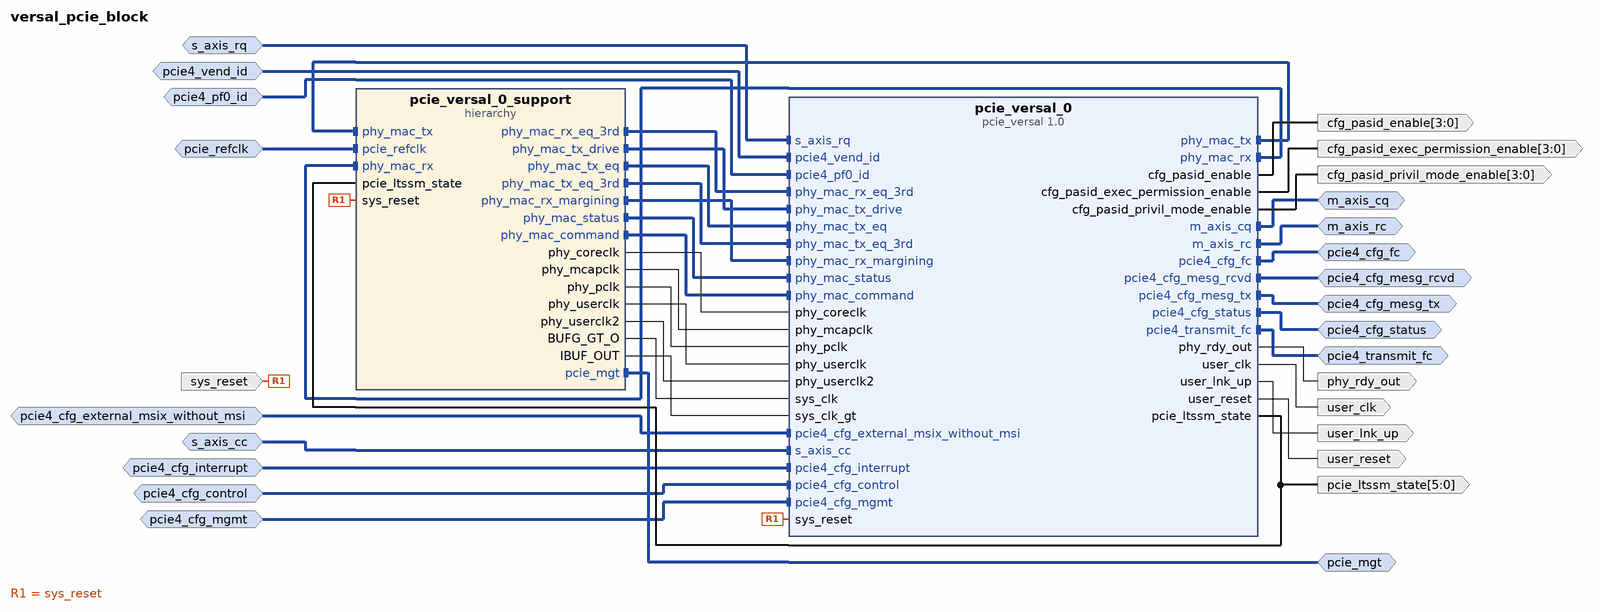
[diagram p0: block diagram of the top level]
# Vivado block design versal_pcie_block, xcvm1802-vsva2197-2MP-e-S-es1, Vivado 2020.1
create_bd_design versal_pcie_block

create_bd_intf_port -mode Slave -vlnv xilinx.com:interface:diff_clock_rtl:1.0 pcie_refclk
create_bd_intf_port -mode Master -vlnv xilinx.com:interface:gt_rtl:1.0 pcie_mgt
create_bd_intf_port -mode Slave -vlnv xilinx.com:interface:axis_rtl:1.0 s_axis_cc
set_property -dict [list \
  CONFIG.TDATA_NUM_BYTES 64 \
  CONFIG.TDEST_WIDTH 0 \
  CONFIG.TID_WIDTH 0 \
  CONFIG.TUSER_WIDTH 81 \
  CONFIG.HAS_TREADY 1 \
  CONFIG.HAS_TSTRB 0 \
  CONFIG.HAS_TKEEP 1 \
  CONFIG.HAS_TLAST 1 \
  CONFIG.FREQ_HZ 250000000 \
  CONFIG.LAYERED_METADATA undef \
] [get_bd_intf_ports s_axis_cc]
create_bd_intf_port -mode Slave -vlnv xilinx.com:interface:pcie4_cfg_mgmt_rtl:1.0 pcie4_cfg_mgmt
create_bd_intf_port -mode Slave -vlnv xilinx.com:interface:pcie4_pcie_id_rtl:1.0 pcie4_vend_id
create_bd_intf_port -mode Slave -vlnv xilinx.com:interface:axis_rtl:1.0 s_axis_rq
set_property -dict [list \
  CONFIG.TDATA_NUM_BYTES 64 \
  CONFIG.TDEST_WIDTH 0 \
  CONFIG.TID_WIDTH 0 \
  CONFIG.TUSER_WIDTH 183 \
  CONFIG.HAS_TREADY 1 \
  CONFIG.HAS_TSTRB 0 \
  CONFIG.HAS_TKEEP 1 \
  CONFIG.HAS_TLAST 1 \
  CONFIG.FREQ_HZ 250000000 \
  CONFIG.LAYERED_METADATA undef \
] [get_bd_intf_ports s_axis_rq]
create_bd_intf_port -mode Slave -vlnv xilinx.com:interface:pcie4_cfg_msix_rtl:1.0 pcie4_cfg_external_msix_without_msi
create_bd_intf_port -mode Slave -vlnv xilinx.com:interface:pcie3_cfg_interrupt_rtl:1.0 pcie4_cfg_interrupt
create_bd_intf_port -mode Slave -vlnv xilinx.com:interface:pcie4_cfg_control_rtl:1.0 pcie4_cfg_control
create_bd_intf_port -mode Slave -vlnv xilinx.com:interface:pcie4_pcie_id_rtl:1.0 pcie4_pf0_id
create_bd_intf_port -mode Master -vlnv xilinx.com:interface:pcie3_cfg_mesg_tx_rtl:1.0 pcie4_cfg_mesg_tx
create_bd_intf_port -mode Master -vlnv xilinx.com:interface:axis_rtl:1.0 m_axis_rc
set_property -dict {CONFIG.FREQ_HZ 250000000} [get_bd_intf_ports m_axis_rc]
create_bd_intf_port -mode Master -vlnv xilinx.com:interface:pcie4_cfg_status_rtl:1.0 pcie4_cfg_status
create_bd_intf_port -mode Master -vlnv xilinx.com:interface:pcie3_transmit_fc_rtl:1.0 pcie4_transmit_fc
create_bd_intf_port -mode Master -vlnv xilinx.com:interface:pcie_cfg_fc_rtl:1.1 pcie4_cfg_fc
create_bd_intf_port -mode Master -vlnv xilinx.com:interface:pcie3_cfg_msg_received_rtl:1.0 pcie4_cfg_mesg_rcvd
create_bd_intf_port -mode Master -vlnv xilinx.com:interface:axis_rtl:1.0 m_axis_cq
set_property -dict {CONFIG.FREQ_HZ 250000000} [get_bd_intf_ports m_axis_cq]
create_bd_port -dir I -type rst sys_reset
create_bd_port -dir O -from 3 -to 0 cfg_pasid_privil_mode_enable
create_bd_port -dir O -from 3 -to 0 cfg_pasid_exec_permission_enable
create_bd_port -dir O phy_rdy_out
create_bd_port -dir O -from 3 -to 0 cfg_pasid_enable
create_bd_port -dir O -from 5 -to 0 pcie_ltssm_state
create_bd_port -dir O user_lnk_up
create_bd_port -dir O -type rst user_reset
create_bd_port -dir O -type clk user_clk
set_property -dict [list \
  CONFIG.ASSOCIATED_BUSIF s_axis_cc:s_axis_rq:m_axis_rc:m_axis_cq \
  CONFIG.FREQ_HZ 250000000 \
] [get_bd_ports user_clk]

create_bd_cell -type ip -vlnv xilinx.com:ip:pcie_versal:1.0 pcie_versal_0
set_property -dict [list \
  CONFIG.AXISTEN_IF_EXT_512_RQ_STRADDLE false \
  CONFIG.MSI_X_OPTIONS MSI-X_External \
  CONFIG.PF0_MSIX_CAP_PBA_BIR BAR_1 \
  CONFIG.PF0_MSIX_CAP_PBA_OFFSET 00000400 \
  CONFIG.PF0_MSIX_CAP_TABLE_BIR BAR_1 \
  CONFIG.PF0_MSIX_CAP_TABLE_OFFSET 00000000 \
  CONFIG.PF0_MSIX_CAP_TABLE_SIZE 007 \
  CONFIG.PL_LINK_CAP_MAX_LINK_SPEED 16.0_GT/s \
  CONFIG.PL_LINK_CAP_MAX_LINK_WIDTH X8 \
  CONFIG.mode_selection Advanced \
  CONFIG.pcie_blk_locn X0Y1 \
  CONFIG.pcie_id_if true \
  CONFIG.pf0_bar0_scale Megabytes \
  CONFIG.pf0_bar0_size 1 \
  CONFIG.pf0_bar1_enabled true \
  CONFIG.pf0_bar1_scale Megabytes \
  CONFIG.pf0_bar1_size 1 \
  CONFIG.pf0_bar1_type Memory \
  CONFIG.pf0_bar2_enabled true \
  CONFIG.pf0_bar2_scale Megabytes \
  CONFIG.pf0_bar2_size 1 \
  CONFIG.pf0_bar2_type Memory \
  CONFIG.pf0_msi_enabled false \
  CONFIG.pf0_msix_enabled true \
] [get_bd_cells pcie_versal_0]
create_bd_cell -type hier pcie_versal_0_support

# ---- hierarchy /pcie_versal_0_support ----
current_bd_instance /pcie_versal_0_support
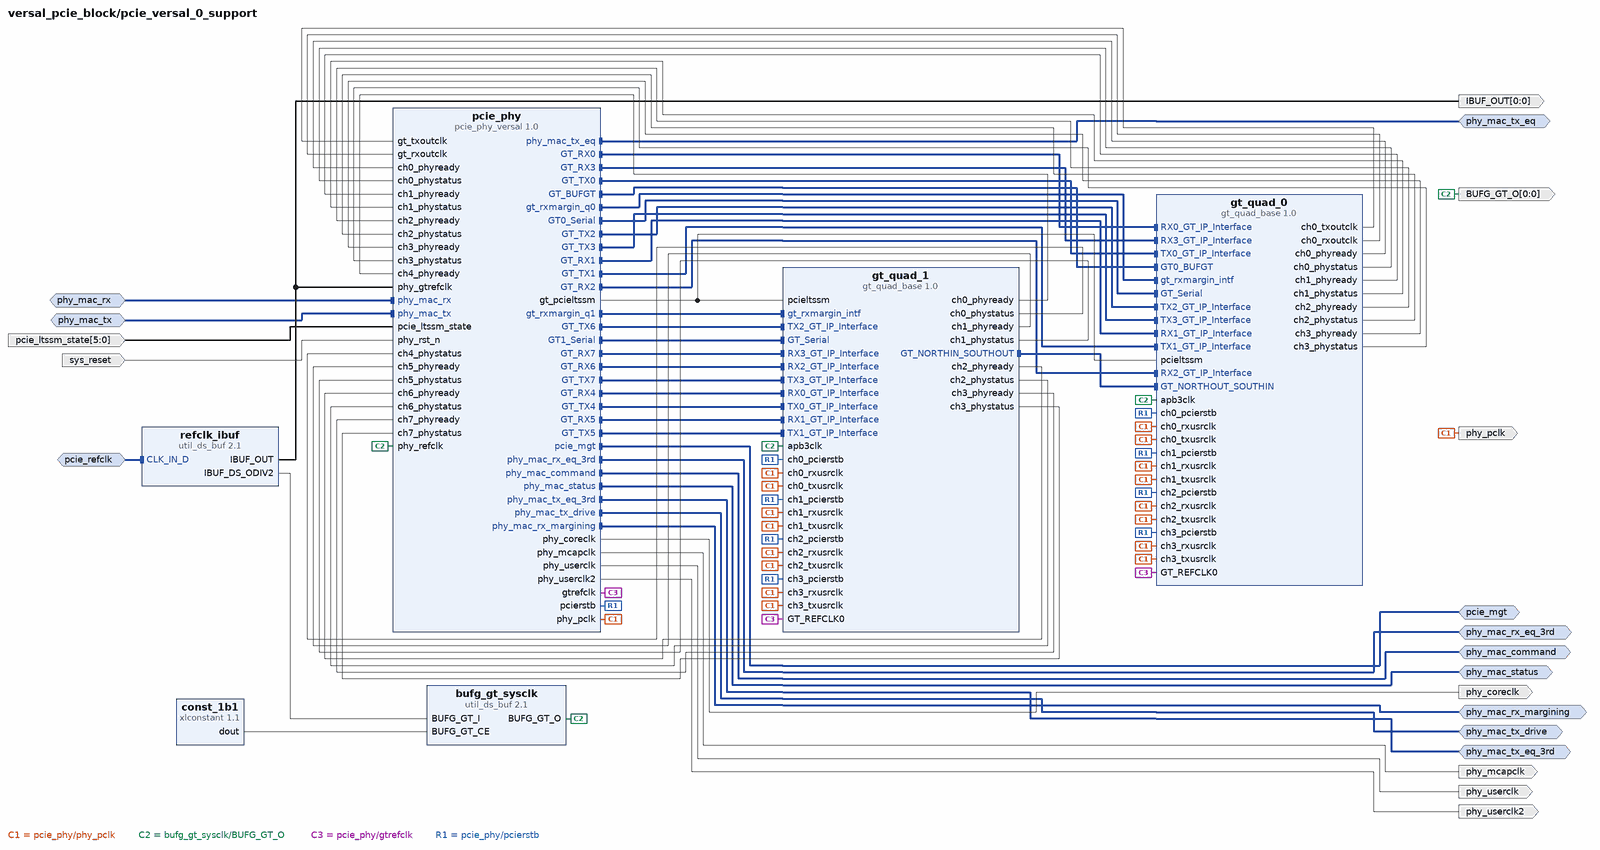
[diagram p1: block diagram inside /pcie_versal_0_support]
create_bd_intf_pin -mode Master -vlnv xilinx.com:display_phy:phy_mac_command_rtl:1.0 phy_mac_command
create_bd_intf_pin -mode Slave -vlnv xilinx.com:display_phy:phy_mac_rx_rtl:1.0 phy_mac_rx
create_bd_intf_pin -mode Master -vlnv xilinx.com:display_phy:phy_mac_rx_eq_3rd_rtl:1.0 phy_mac_rx_eq_3rd
create_bd_intf_pin -mode Master -vlnv xilinx.com:display_phy:phy_mac_rx_margining_rtl:1.0 phy_mac_rx_margining
create_bd_intf_pin -mode Master -vlnv xilinx.com:display_phy:phy_mac_status_rtl:1.0 phy_mac_status
create_bd_intf_pin -mode Slave -vlnv xilinx.com:display_phy:phy_mac_tx_rtl:1.0 phy_mac_tx
create_bd_intf_pin -mode Master -vlnv xilinx.com:display_phy:phy_mac_tx_drive_rtl:1.0 phy_mac_tx_drive
create_bd_intf_pin -mode Master -vlnv xilinx.com:display_phy:phy_mac_tx_eq_rtl:1.0 phy_mac_tx_eq
create_bd_intf_pin -mode Master -vlnv xilinx.com:display_phy:phy_mac_tx_eq_3rd_rtl:1.0 phy_mac_tx_eq_3rd
create_bd_intf_pin -mode Slave -vlnv xilinx.com:interface:diff_clock_rtl:1.0 pcie_refclk
create_bd_intf_pin -mode Master -vlnv xilinx.com:interface:gt_rtl:1.0 pcie_mgt
create_bd_pin -dir I -from 5 -to 0 pcie_ltssm_state
create_bd_pin -dir O -type clk phy_coreclk
create_bd_pin -dir O -type clk phy_mcapclk
create_bd_pin -dir O -type gt_usrclk phy_pclk
create_bd_pin -dir O -type clk phy_userclk
create_bd_pin -dir O -type clk phy_userclk2
create_bd_pin -dir I -type rst sys_reset
create_bd_pin -dir O -from 0 -to 0 -type clk BUFG_GT_O
create_bd_pin -dir O -from 0 -to 0 -type clk IBUF_OUT

create_bd_cell -type ip -vlnv xilinx.com:ip:pcie_phy_versal:1.0 pcie_phy
set_property -dict [list \
  CONFIG.PL_LINK_CAP_MAX_LINK_SPEED 16.0_GT/s \
  CONFIG.PL_LINK_CAP_MAX_LINK_WIDTH X8 \
  CONFIG.aspm No_ASPM \
  CONFIG.disable_double_pipe false \
  CONFIG.en_gt_pclk false \
  CONFIG.ins_loss_profile Add-in_Card \
  CONFIG.lane_order Bottom \
  CONFIG.lane_reversal false \
  CONFIG.phy_async_en true \
  CONFIG.phy_coreclk_freq 500_MHz \
  CONFIG.phy_refclk_freq 100_MHz \
  CONFIG.phy_userclk_freq 250_MHz \
  CONFIG.pipeline_stages 1 \
  CONFIG.tx_preset 4 \
] [get_bd_cells pcie_phy]
create_bd_cell -type ip -vlnv xilinx.com:ip:xlconstant:1.1 const_1b1
set_property -dict {CONFIG.CONST_VAL 1 CONFIG.CONST_WIDTH 1} [get_bd_cells const_1b1]
create_bd_cell -type ip -vlnv xilinx.com:ip:util_ds_buf:2.1 refclk_ibuf
set_property -dict {CONFIG.C_BUF_TYPE IBUFDSGTE} [get_bd_cells refclk_ibuf]
create_bd_cell -type ip -vlnv xilinx.com:ip:util_ds_buf:2.1 bufg_gt_sysclk
set_property -dict {CONFIG.C_BUFG_GT_SYNC true CONFIG.C_BUF_TYPE BUFG_GT} [get_bd_cells bufg_gt_sysclk]
create_bd_cell -type ip -vlnv xilinx.com:ip:gt_quad_base:1.0 gt_quad_0
set_property -dict [list \
  CONFIG.REFCLK_STRING {HSCLK0_LCPLLGTREFCLK0 refclk_PROT0_R0_100.000000_MHz_unique1 HSCLK0_RPLLGTREFCLK0 refclk_PROT0_R0_100.000000_MHz_unique1 HSCLK1_LCPLLGTREFCLK0 refclk_PROT0_R0_100.000000_MHz_unique1 HSCLK1_RPLLGTREFCLK0 refclk_PROT0_R0_100.000000_MHz_unique1} \
] [get_bd_cells gt_quad_0]
create_bd_cell -type ip -vlnv xilinx.com:ip:gt_quad_base:1.0 gt_quad_1
set_property -dict [list \
  CONFIG.REFCLK_STRING {HSCLK0_LCPLLGTREFCLK0 refclk_PROT0_R0_100.000000_MHz_unique1 HSCLK0_RPLLGTREFCLK0 refclk_PROT0_R0_100.000000_MHz_unique1 HSCLK1_LCPLLGTREFCLK0 refclk_PROT0_R0_100.000000_MHz_unique1 HSCLK1_RPLLGTREFCLK0 refclk_PROT0_R0_100.000000_MHz_unique1} \
] [get_bd_cells gt_quad_1]

# ---- connections ----

current_bd_instance /pcie_versal_0_support
connect_bd_intf_net [get_bd_intf_pins pcie_refclk] [get_bd_intf_pins refclk_ibuf/CLK_IN_D]
connect_bd_intf_net [get_bd_intf_pins pcie_phy/GT_RX0] [get_bd_intf_pins gt_quad_0/RX0_GT_IP_Interface]
connect_bd_intf_net [get_bd_intf_pins pcie_phy/GT_RX3] [get_bd_intf_pins gt_quad_0/RX3_GT_IP_Interface]
connect_bd_intf_net [get_bd_intf_pins phy_mac_tx_eq] [get_bd_intf_pins pcie_phy/phy_mac_tx_eq]
connect_bd_intf_net [get_bd_intf_pins pcie_phy/GT_TX0] [get_bd_intf_pins gt_quad_0/TX0_GT_IP_Interface]
connect_bd_intf_net [get_bd_intf_pins pcie_phy/gt_rxmargin_q1] [get_bd_intf_pins gt_quad_1/gt_rxmargin_intf]
connect_bd_intf_net [get_bd_intf_pins pcie_phy/GT_BUFGT] [get_bd_intf_pins gt_quad_0/GT0_BUFGT]
connect_bd_intf_net [get_bd_intf_pins pcie_phy/GT_TX6] [get_bd_intf_pins gt_quad_1/TX2_GT_IP_Interface]
connect_bd_intf_net [get_bd_intf_pins pcie_phy/gt_rxmargin_q0] [get_bd_intf_pins gt_quad_0/gt_rxmargin_intf]
connect_bd_intf_net [get_bd_intf_pins pcie_phy/GT0_Serial] [get_bd_intf_pins gt_quad_0/GT_Serial]
connect_bd_intf_net [get_bd_intf_pins pcie_phy/GT1_Serial] [get_bd_intf_pins gt_quad_1/GT_Serial]
connect_bd_intf_net [get_bd_intf_pins pcie_mgt] [get_bd_intf_pins pcie_phy/pcie_mgt]
connect_bd_intf_net [get_bd_intf_pins pcie_phy/GT_RX7] [get_bd_intf_pins gt_quad_1/RX3_GT_IP_Interface]
connect_bd_intf_net [get_bd_intf_pins pcie_phy/GT_RX6] [get_bd_intf_pins gt_quad_1/RX2_GT_IP_Interface]
connect_bd_intf_net [get_bd_intf_pins pcie_phy/GT_TX7] [get_bd_intf_pins gt_quad_1/TX3_GT_IP_Interface]
connect_bd_intf_net [get_bd_intf_pins gt_quad_1/GT_NORTHIN_SOUTHOUT] [get_bd_intf_pins gt_quad_0/GT_NORTHOUT_SOUTHIN]
connect_bd_intf_net [get_bd_intf_pins phy_mac_rx] [get_bd_intf_pins pcie_phy/phy_mac_rx]
connect_bd_intf_net [get_bd_intf_pins pcie_phy/GT_RX4] [get_bd_intf_pins gt_quad_1/RX0_GT_IP_Interface]
connect_bd_intf_net [get_bd_intf_pins pcie_phy/GT_TX4] [get_bd_intf_pins gt_quad_1/TX0_GT_IP_Interface]
connect_bd_intf_net [get_bd_intf_pins phy_mac_rx_eq_3rd] [get_bd_intf_pins pcie_phy/phy_mac_rx_eq_3rd]
connect_bd_intf_net [get_bd_intf_pins pcie_phy/GT_TX2] [get_bd_intf_pins gt_quad_0/TX2_GT_IP_Interface]
connect_bd_intf_net [get_bd_intf_pins pcie_phy/GT_RX5] [get_bd_intf_pins gt_quad_1/RX1_GT_IP_Interface]
connect_bd_intf_net [get_bd_intf_pins pcie_phy/GT_TX3] [get_bd_intf_pins gt_quad_0/TX3_GT_IP_Interface]
connect_bd_intf_net [get_bd_intf_pins pcie_phy/GT_RX1] [get_bd_intf_pins gt_quad_0/RX1_GT_IP_Interface]
connect_bd_intf_net [get_bd_intf_pins pcie_phy/GT_TX5] [get_bd_intf_pins gt_quad_1/TX1_GT_IP_Interface]
connect_bd_intf_net [get_bd_intf_pins pcie_phy/GT_TX1] [get_bd_intf_pins gt_quad_0/TX1_GT_IP_Interface]
connect_bd_intf_net [get_bd_intf_pins phy_mac_command] [get_bd_intf_pins pcie_phy/phy_mac_command]
connect_bd_intf_net [get_bd_intf_pins phy_mac_status] [get_bd_intf_pins pcie_phy/phy_mac_status]
connect_bd_intf_net [get_bd_intf_pins phy_mac_tx_eq_3rd] [get_bd_intf_pins pcie_phy/phy_mac_tx_eq_3rd]
connect_bd_intf_net [get_bd_intf_pins phy_mac_tx_drive] [get_bd_intf_pins pcie_phy/phy_mac_tx_drive]
connect_bd_intf_net [get_bd_intf_pins phy_mac_tx] [get_bd_intf_pins pcie_phy/phy_mac_tx]
connect_bd_intf_net [get_bd_intf_pins phy_mac_rx_margining] [get_bd_intf_pins pcie_phy/phy_mac_rx_margining]
connect_bd_intf_net [get_bd_intf_pins pcie_phy/GT_RX2] [get_bd_intf_pins gt_quad_0/RX2_GT_IP_Interface]
connect_bd_net [get_bd_pins pcie_ltssm_state] [get_bd_pins pcie_phy/pcie_ltssm_state]
connect_bd_net [get_bd_pins pcie_phy/phy_coreclk] [get_bd_pins phy_coreclk]
connect_bd_net [get_bd_pins pcie_phy/phy_mcapclk] [get_bd_pins phy_mcapclk]
connect_bd_net [get_bd_pins pcie_phy/phy_pclk] \
  [get_bd_pins phy_pclk] [get_bd_pins gt_quad_0/ch0_txusrclk] [get_bd_pins gt_quad_0/ch1_txusrclk] \
  [get_bd_pins gt_quad_0/ch2_txusrclk] [get_bd_pins gt_quad_0/ch3_txusrclk] [get_bd_pins gt_quad_1/ch0_txusrclk] \
  [get_bd_pins gt_quad_1/ch1_txusrclk] [get_bd_pins gt_quad_1/ch2_txusrclk] [get_bd_pins gt_quad_1/ch3_txusrclk] \
  [get_bd_pins gt_quad_0/ch0_rxusrclk] [get_bd_pins gt_quad_0/ch1_rxusrclk] [get_bd_pins gt_quad_0/ch2_rxusrclk] \
  [get_bd_pins gt_quad_0/ch3_rxusrclk] [get_bd_pins gt_quad_1/ch0_rxusrclk] [get_bd_pins gt_quad_1/ch1_rxusrclk] \
  [get_bd_pins gt_quad_1/ch2_rxusrclk] [get_bd_pins gt_quad_1/ch3_rxusrclk]
connect_bd_net [get_bd_pins pcie_phy/phy_userclk] [get_bd_pins phy_userclk]
connect_bd_net [get_bd_pins pcie_phy/phy_userclk2] [get_bd_pins phy_userclk2]
connect_bd_net [get_bd_pins sys_reset] [get_bd_pins pcie_phy/phy_rst_n]
connect_bd_net [get_bd_pins const_1b1/dout] [get_bd_pins bufg_gt_sysclk/BUFG_GT_CE]
connect_bd_net [get_bd_pins refclk_ibuf/IBUF_OUT] [get_bd_pins pcie_phy/phy_gtrefclk] [get_bd_pins IBUF_OUT]
connect_bd_net [get_bd_pins bufg_gt_sysclk/BUFG_GT_O] \
  [get_bd_pins pcie_phy/phy_refclk] [get_bd_pins gt_quad_0/apb3clk] [get_bd_pins gt_quad_1/apb3clk] [get_bd_pins BUFG_GT_O]
connect_bd_net [get_bd_pins refclk_ibuf/IBUF_DS_ODIV2] [get_bd_pins bufg_gt_sysclk/BUFG_GT_I]
connect_bd_net [get_bd_pins gt_quad_0/ch0_txoutclk] [get_bd_pins pcie_phy/gt_txoutclk]
connect_bd_net [get_bd_pins gt_quad_0/ch0_rxoutclk] [get_bd_pins pcie_phy/gt_rxoutclk]
connect_bd_net [get_bd_pins pcie_phy/gtrefclk] [get_bd_pins gt_quad_0/GT_REFCLK0] [get_bd_pins gt_quad_1/GT_REFCLK0]
connect_bd_net [get_bd_pins pcie_phy/pcierstb] \
  [get_bd_pins gt_quad_0/ch0_pcierstb] [get_bd_pins gt_quad_0/ch1_pcierstb] [get_bd_pins gt_quad_0/ch2_pcierstb] \
  [get_bd_pins gt_quad_0/ch3_pcierstb] [get_bd_pins gt_quad_1/ch0_pcierstb] [get_bd_pins gt_quad_1/ch1_pcierstb] \
  [get_bd_pins gt_quad_1/ch2_pcierstb] [get_bd_pins gt_quad_1/ch3_pcierstb]
connect_bd_net [get_bd_pins pcie_phy/gt_pcieltssm] [get_bd_pins gt_quad_0/pcieltssm] [get_bd_pins gt_quad_1/pcieltssm]
connect_bd_net [get_bd_pins gt_quad_0/ch0_phyready] [get_bd_pins pcie_phy/ch0_phyready]
connect_bd_net [get_bd_pins gt_quad_0/ch0_phystatus] [get_bd_pins pcie_phy/ch0_phystatus]
connect_bd_net [get_bd_pins gt_quad_0/ch1_phyready] [get_bd_pins pcie_phy/ch1_phyready]
connect_bd_net [get_bd_pins gt_quad_0/ch1_phystatus] [get_bd_pins pcie_phy/ch1_phystatus]
connect_bd_net [get_bd_pins gt_quad_0/ch2_phyready] [get_bd_pins pcie_phy/ch2_phyready]
connect_bd_net [get_bd_pins gt_quad_0/ch2_phystatus] [get_bd_pins pcie_phy/ch2_phystatus]
connect_bd_net [get_bd_pins gt_quad_0/ch3_phyready] [get_bd_pins pcie_phy/ch3_phyready]
connect_bd_net [get_bd_pins gt_quad_0/ch3_phystatus] [get_bd_pins pcie_phy/ch3_phystatus]
connect_bd_net [get_bd_pins gt_quad_1/ch0_phyready] [get_bd_pins pcie_phy/ch4_phyready]
connect_bd_net [get_bd_pins gt_quad_1/ch0_phystatus] [get_bd_pins pcie_phy/ch4_phystatus]
connect_bd_net [get_bd_pins gt_quad_1/ch1_phyready] [get_bd_pins pcie_phy/ch5_phyready]
connect_bd_net [get_bd_pins gt_quad_1/ch1_phystatus] [get_bd_pins pcie_phy/ch5_phystatus]
connect_bd_net [get_bd_pins gt_quad_1/ch2_phyready] [get_bd_pins pcie_phy/ch6_phyready]
connect_bd_net [get_bd_pins gt_quad_1/ch2_phystatus] [get_bd_pins pcie_phy/ch6_phystatus]
connect_bd_net [get_bd_pins gt_quad_1/ch3_phyready] [get_bd_pins pcie_phy/ch7_phyready]
connect_bd_net [get_bd_pins gt_quad_1/ch3_phystatus] [get_bd_pins pcie_phy/ch7_phystatus]

current_bd_instance /
connect_bd_intf_net [get_bd_intf_pins pcie_versal_0/phy_mac_rx_eq_3rd] [get_bd_intf_pins pcie_versal_0_support/phy_mac_rx_eq_3rd]
connect_bd_intf_net [get_bd_intf_pins pcie_versal_0/phy_mac_tx_drive] [get_bd_intf_pins pcie_versal_0_support/phy_mac_tx_drive]
connect_bd_intf_net [get_bd_intf_ports pcie4_transmit_fc] [get_bd_intf_pins pcie_versal_0/pcie4_transmit_fc]
connect_bd_intf_net -intf_net s_axis_rq_0_1 [get_bd_intf_ports s_axis_rq] [get_bd_intf_pins pcie_versal_0/s_axis_rq]
connect_bd_intf_net [get_bd_intf_ports pcie4_cfg_fc] [get_bd_intf_pins pcie_versal_0/pcie4_cfg_fc]
connect_bd_intf_net [get_bd_intf_ports m_axis_cq] [get_bd_intf_pins pcie_versal_0/m_axis_cq]
connect_bd_intf_net [get_bd_intf_pins pcie_versal_0/phy_mac_tx_eq] [get_bd_intf_pins pcie_versal_0_support/phy_mac_tx_eq]
connect_bd_intf_net [get_bd_intf_ports pcie_mgt] [get_bd_intf_pins pcie_versal_0_support/pcie_mgt]
connect_bd_intf_net [get_bd_intf_ports pcie4_cfg_mesg_tx] [get_bd_intf_pins pcie_versal_0/pcie4_cfg_mesg_tx]
connect_bd_intf_net -intf_net pcie4_vend_id_0_1 [get_bd_intf_ports pcie4_vend_id] [get_bd_intf_pins pcie_versal_0/pcie4_vend_id]
connect_bd_intf_net [get_bd_intf_ports pcie4_cfg_mesg_rcvd] [get_bd_intf_pins pcie_versal_0/pcie4_cfg_mesg_rcvd]
connect_bd_intf_net [get_bd_intf_pins pcie_versal_0/phy_mac_tx_eq_3rd] [get_bd_intf_pins pcie_versal_0_support/phy_mac_tx_eq_3rd]
connect_bd_intf_net -intf_net pcie4_pf0_id_0_1 [get_bd_intf_ports pcie4_pf0_id] [get_bd_intf_pins pcie_versal_0/pcie4_pf0_id]
connect_bd_intf_net [get_bd_intf_ports m_axis_rc] [get_bd_intf_pins pcie_versal_0/m_axis_rc]
connect_bd_intf_net [get_bd_intf_pins pcie_versal_0/phy_mac_tx] [get_bd_intf_pins pcie_versal_0_support/phy_mac_tx]
connect_bd_intf_net [get_bd_intf_ports pcie_refclk] [get_bd_intf_pins pcie_versal_0_support/pcie_refclk]
connect_bd_intf_net [get_bd_intf_pins pcie_versal_0/phy_mac_rx_margining] [get_bd_intf_pins pcie_versal_0_support/phy_mac_rx_margining]
connect_bd_intf_net -intf_net pcie4_cfg_external_msix_without_msi_0_1 [get_bd_intf_ports pcie4_cfg_external_msix_without_msi] [get_bd_intf_pins pcie_versal_0/pcie4_cfg_external_msix_without_msi]
connect_bd_intf_net -intf_net s_axis_cc_0_1 [get_bd_intf_ports s_axis_cc] [get_bd_intf_pins pcie_versal_0/s_axis_cc]
connect_bd_intf_net [get_bd_intf_pins pcie_versal_0/phy_mac_status] [get_bd_intf_pins pcie_versal_0_support/phy_mac_status]
connect_bd_intf_net [get_bd_intf_pins pcie_versal_0/phy_mac_rx] [get_bd_intf_pins pcie_versal_0_support/phy_mac_rx]
connect_bd_intf_net [get_bd_intf_pins pcie_versal_0/phy_mac_command] [get_bd_intf_pins pcie_versal_0_support/phy_mac_command]
connect_bd_intf_net -intf_net pcie4_cfg_interrupt_0_1 [get_bd_intf_ports pcie4_cfg_interrupt] [get_bd_intf_pins pcie_versal_0/pcie4_cfg_interrupt]
connect_bd_intf_net -intf_net pcie4_cfg_control_0_1 [get_bd_intf_ports pcie4_cfg_control] [get_bd_intf_pins pcie_versal_0/pcie4_cfg_control]
connect_bd_intf_net -intf_net pcie4_cfg_mgmt_0_1 [get_bd_intf_ports pcie4_cfg_mgmt] [get_bd_intf_pins pcie_versal_0/pcie4_cfg_mgmt]
connect_bd_intf_net [get_bd_intf_ports pcie4_cfg_status] [get_bd_intf_pins pcie_versal_0/pcie4_cfg_status]
connect_bd_net [get_bd_pins pcie_versal_0_support/phy_coreclk] [get_bd_pins pcie_versal_0/phy_coreclk]
connect_bd_net [get_bd_pins pcie_versal_0_support/phy_mcapclk] [get_bd_pins pcie_versal_0/phy_mcapclk]
connect_bd_net [get_bd_pins pcie_versal_0_support/phy_pclk] [get_bd_pins pcie_versal_0/phy_pclk]
connect_bd_net [get_bd_pins pcie_versal_0_support/phy_userclk] [get_bd_pins pcie_versal_0/phy_userclk]
connect_bd_net [get_bd_pins pcie_versal_0_support/phy_userclk2] [get_bd_pins pcie_versal_0/phy_userclk2]
connect_bd_net [get_bd_ports sys_reset] [get_bd_pins pcie_versal_0_support/sys_reset] [get_bd_pins pcie_versal_0/sys_reset]
connect_bd_net [get_bd_pins pcie_versal_0_support/BUFG_GT_O] [get_bd_pins pcie_versal_0/sys_clk]
connect_bd_net [get_bd_pins pcie_versal_0_support/IBUF_OUT] [get_bd_pins pcie_versal_0/sys_clk_gt]
connect_bd_net [get_bd_pins pcie_versal_0/cfg_pasid_privil_mode_enable] [get_bd_ports cfg_pasid_privil_mode_enable]
connect_bd_net [get_bd_pins pcie_versal_0/cfg_pasid_exec_permission_enable] [get_bd_ports cfg_pasid_exec_permission_enable]
connect_bd_net [get_bd_pins pcie_versal_0/phy_rdy_out] [get_bd_ports phy_rdy_out]
connect_bd_net [get_bd_pins pcie_versal_0/cfg_pasid_enable] [get_bd_ports cfg_pasid_enable]
connect_bd_net [get_bd_pins pcie_versal_0/pcie_ltssm_state] [get_bd_ports pcie_ltssm_state] [get_bd_pins pcie_versal_0_support/pcie_ltssm_state]
connect_bd_net [get_bd_pins pcie_versal_0/user_lnk_up] [get_bd_ports user_lnk_up]
connect_bd_net [get_bd_pins pcie_versal_0/user_reset] [get_bd_ports user_reset]
connect_bd_net [get_bd_pins pcie_versal_0/user_clk] [get_bd_ports user_clk]

validate_bd_design
save_bd_design
